# Altium schematic sheet 电机驱动电路.SchDoc
size A4
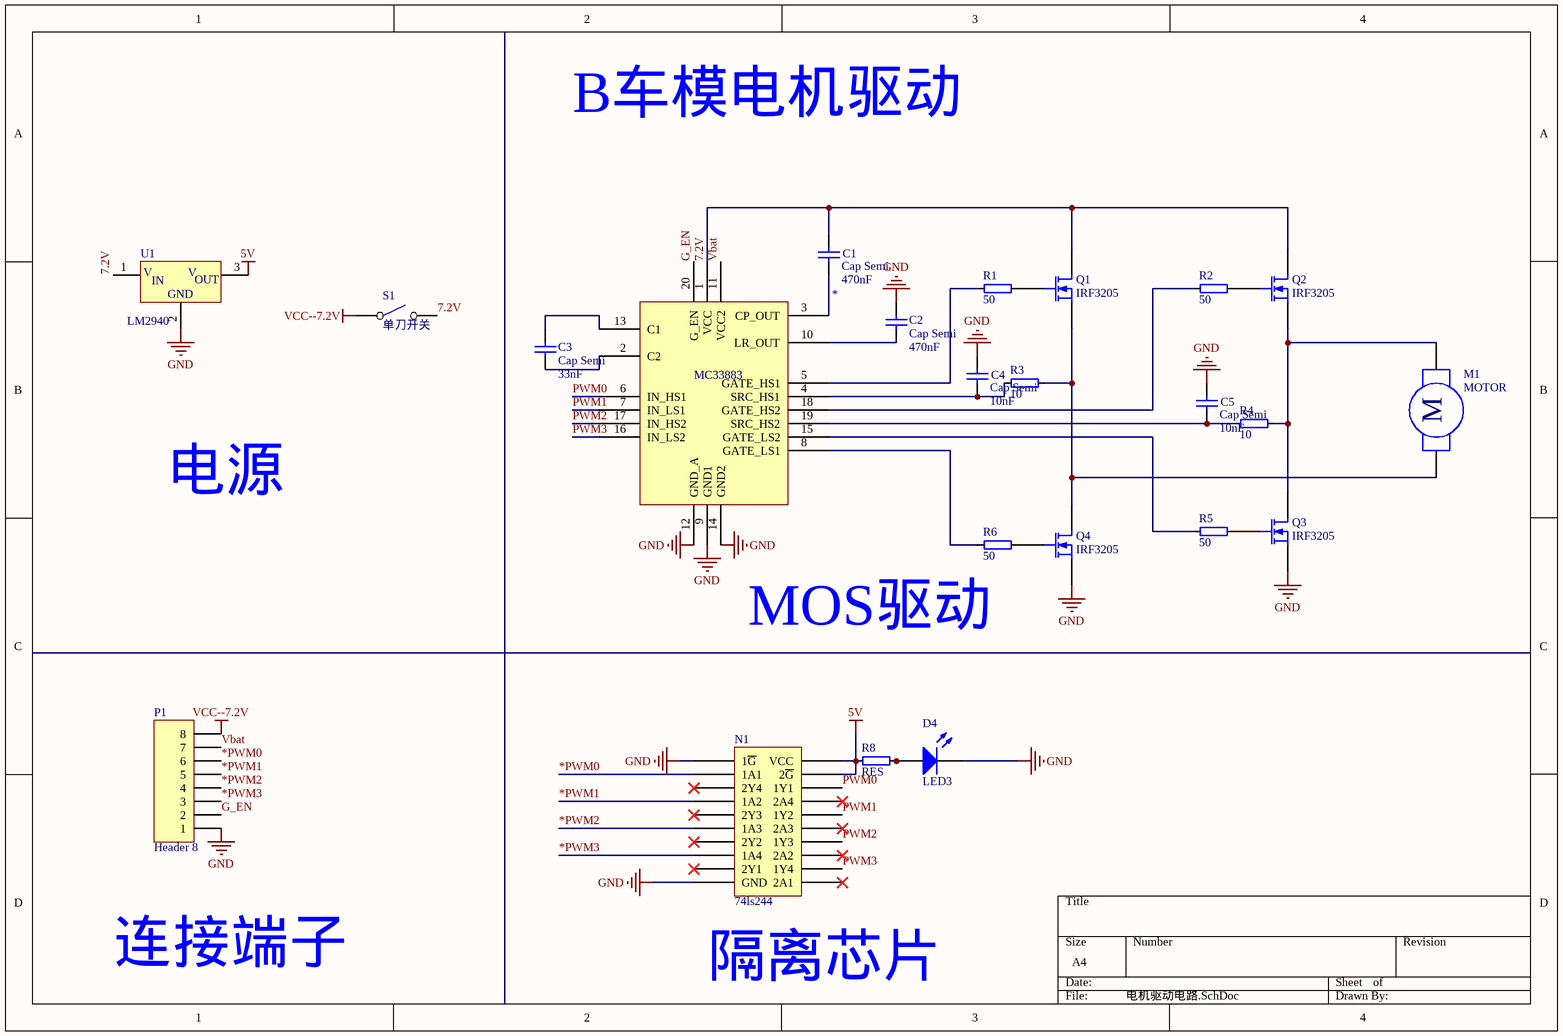
[diagram p0: 电机驱动电路.SchDoc]

## Parts
*  MC33883  [20-TERMINAL SOICW]
C1  Cap Semi  value 470nF  [C1206]
C2  Cap Semi  value 470nF  [C1206]
C3  Cap Semi  value 33nF  [C1206]
C4  Cap Semi  value 10nF  [C1206]
C5  Cap Semi  value 10nF  [C1206]
D4  LED3  [3.5X2.8X1.9]
M1  MOTOR  [两口插座（绿）]
N1  74ls244  [DIP20]
P1  Header 8  [HDR1X8]
Q1  IRF3205  [IRF3205]
Q2  IRF3205  [IRF3205]
Q3  IRF3205  [IRF3205]
Q4  IRF3205  [IRF3205]
R1  50  [0805]
R2  50  [0805]
R3  10  [0805]
R4  10  [0805]
R5  50  [0805]
R6  50  [0805]
R8  RES  [0805]
S1  单刀开关  [DG1282-5.0]
U1  LM2940  [78XX]

## Nets
5V: N1.19(2~{G}) N1.20(VCC) R8.1 U1.3(VOUT)
GND: *.9(GND1) *.12(GND_A) *.14(GND2) C2.1 C4.2 C5.2 D4.2(K) N1.1(1~{G}) N1.10(GND) P1.1 Q3.3(S) Q4.3(S) U1.2(GND)
VCC--7.2V: P1.8 S1.1
7.2V: *.1(VCC) C1.2 Q1.1(D) Q2.1(D) S1.2 U1.1(VIN)
*PWM0: N1.2(1A1) P1.6
*PWM1: N1.4(1A2) P1.5
*PWM2: N1.6(1A3) P1.4
*PWM3: N1.8(1A4) P1.3
G_EN: *.20(G_EN) P1.2
PWM0: *.6(IN_HS1) N1.18(1Y1)
PWM1: *.7(IN_LS1) N1.16(1Y2)
PWM2: *.17(IN_HS2) N1.14(1Y3)
PWM3: *.16(IN_LS2) N1.12(1Y4)
Vbat: *.11(VCC2) P1.7
Net*_2: *.2(C2) C3.1
Net*_3: *.3(CP_OUT) C1.1
Net*_4: *.4(SRC_HS1) C4.1 R3.1
Net*_5: *.5(GATE_HS1) R1.1
Net*_8: *.8(GATE_LS1) R6.1
Net*_10: *.10(LR_OUT) C2.2
Net*_13: *.13(C1) C3.2
Net*_15: *.15(GATE_LS2) R5.1
Net*_18: *.18(GATE_HS2) R2.1
Net*_19: *.19(SRC_HS2) C5.1 R4.1
NetD4_1: D4.1(A) R8.2
NetM1_1: M1.1 Q2.3(S) Q3.1(D) R4.2
NetM1_2: M1.2 Q1.3(S) Q4.1(D) R3.2
NetQ1_2: Q1.2(G) R1.2
NetQ2_2: Q2.2(G) R2.2
NetQ3_2: Q3.2(G) R5.2
NetQ4_2: Q4.2(G) R6.2

Not connected (* = marked no-connect by the designer): N1 3(2Y4)* 5(2Y3)* 7(2Y2)* 9(2Y1)* 11(2A1)* 13(2A2)* 15(2A3)* 17(2A4)*

## Notes on the sheet
- Labels drawn without touching a wire or pin: B车模电机驱动, MOS驱动, 电源, 连接端子, 隔离芯片
- (in symbol 78L05) V; IN; OUT
- (in symbol MOTOR) M

## Library data of the parts
C1-C5 = Cap Semi: Capacitor (Semiconductor SIM Model); Published: 8-Jun-2000; LatestRevisionDate: 17-Jul-2002; LatestRevisionNote: Re-released for DXP Platform.; PackageReference: C1206; Publisher: Altium Limited
D4 = LED3: Typical BLUE SiC LED; Published: 8-Jun-2000; LatestRevisionDate: 17-Dec-2003; LatestRevisionNote: PCB Footprint replaced.; DatasheetDocument: 16-Apr-2002; PackageDocument: 16-Apr-2002; PackageReference: 3.5X2.8X1.9; Publisher: Altium Limited
P1 = Header 8: Header, 8-Pin; LatestRevisionDate: 17-Jul-2002; LatestRevisionNote: Re-released for DXP Platform.; Publisher: Altium Limited
Q1-Q4 = MOSFET-N: N-Channel MOSFET; PackageDocument: 1995/1996; Published: 8-Jun-2000; LatestRevisionDate: 17-Jul-2002; LatestRevisionNote: Re-released for DXP Platform.; PackageReference: E3; Publisher: Altium Limited
R1-R6 = RES
U1 = 78L05: 3-Terminal Positive Voltage Regulator